# EAGLE schematic ESP32-DevKit-Si7021 (EAGLE 9.2.2)
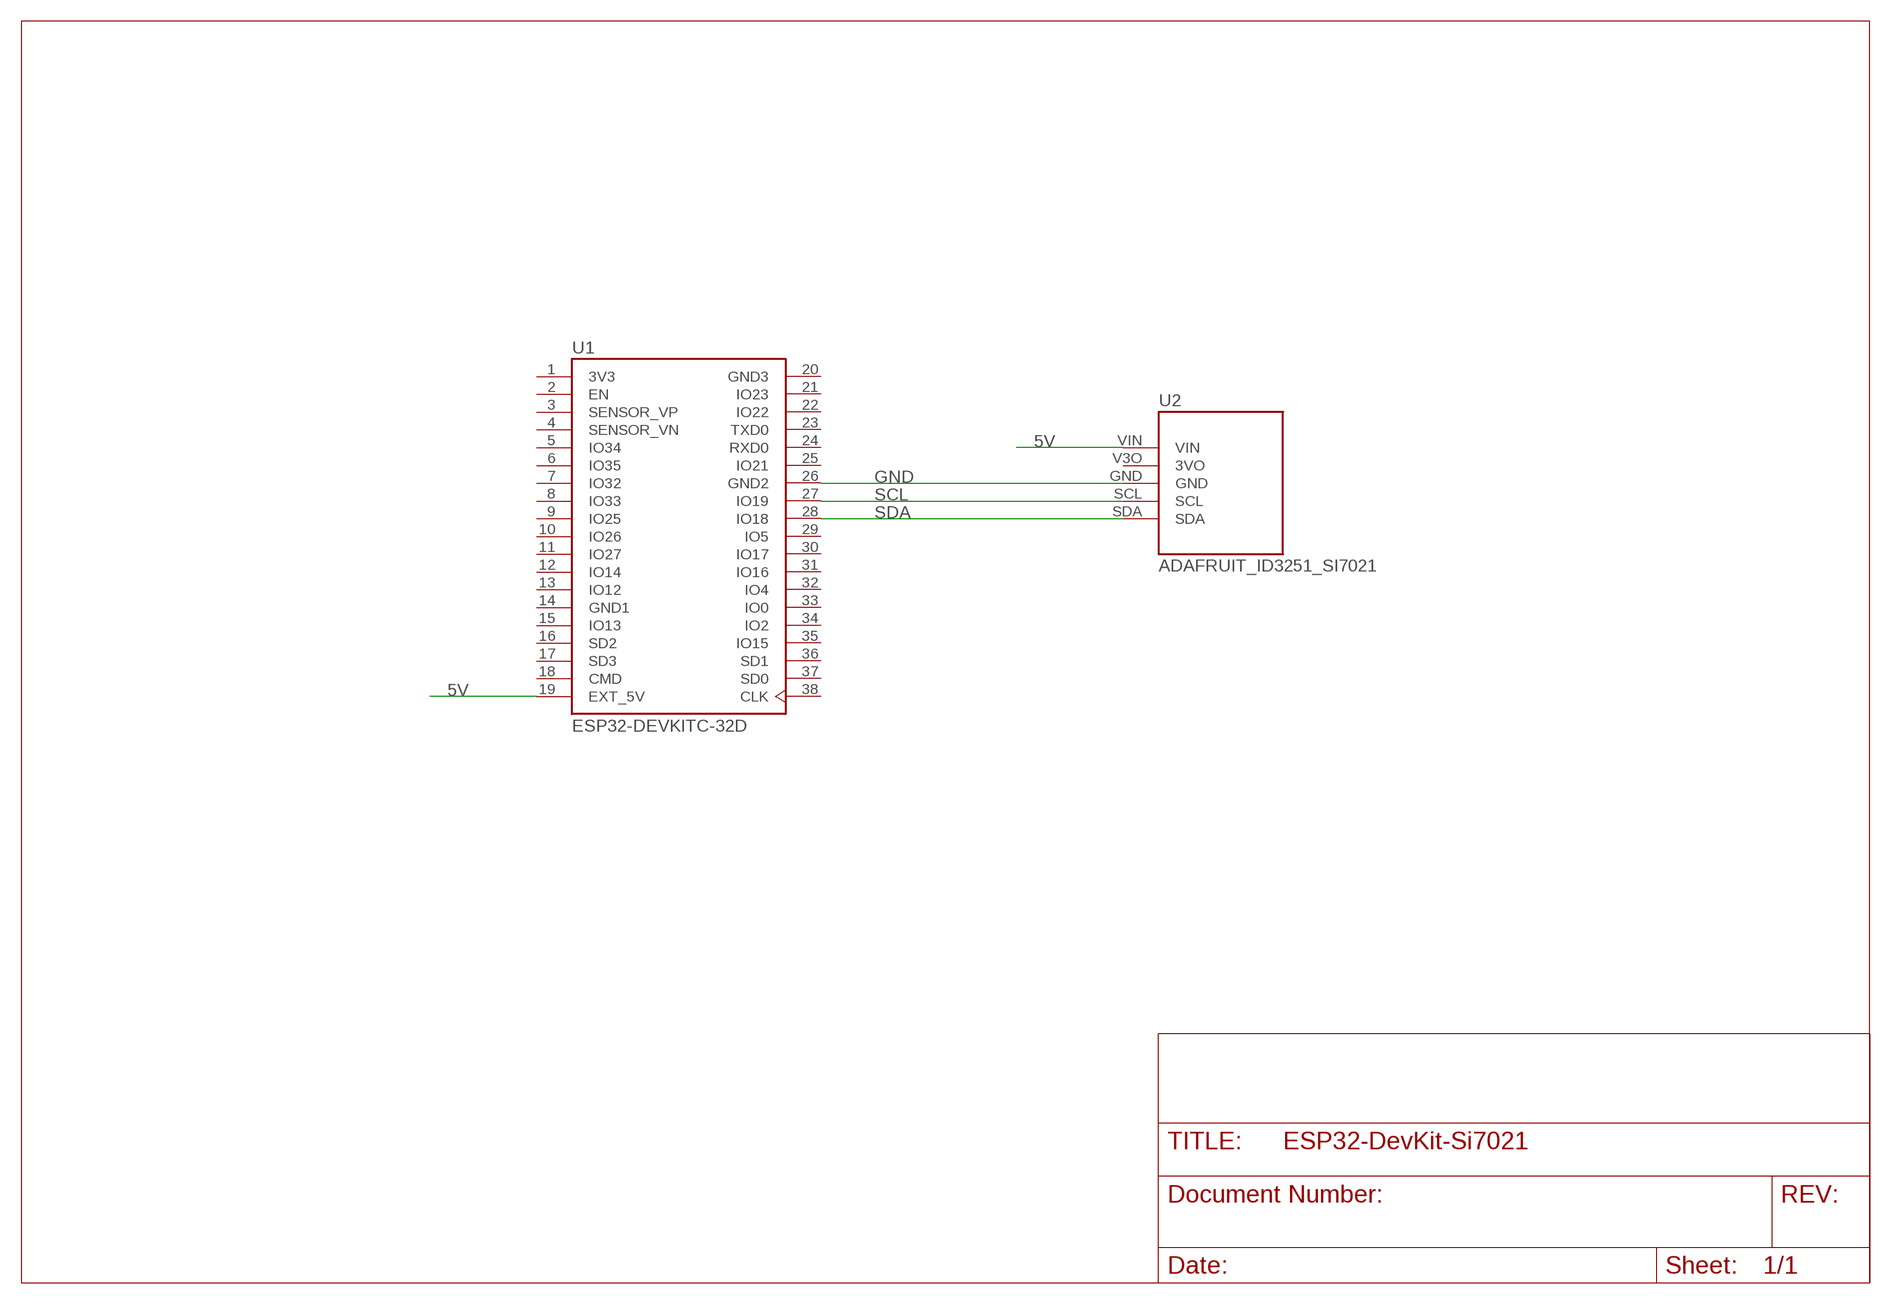
[diagram p0: schematic, sheet 1]

## Parts
U1  ESP32-DEVKITC-32D  [MODULE_ESP32-DEVKITC-32D]
U2  ADAFRUIT_ID3251_SI7021  [ADAFRUIT_ID3251_SI7021]

## Nets
5V: U1.19(EXT_5V) U2.VIN
GND: U1.26(GND2) U2.GND
SCL: U1.27(IO19) U2.SCL
SDA: U1.28(IO18) U2.SDA
Unconnected: U1.2(EN) U1.3(SENSOR_VP) U1.4(SENSOR_VN) U1.5(IO34) U1.6(IO35) U1.7(IO32) U1.8(IO33) U1.9(IO25) U1.10(IO26) U1.11(IO27) U1.12(IO14) U1.13(IO12) U1.15(IO13) U1.16(SD2) U1.17(SD3) U1.18(CMD) U1.21(IO23) U1.22(IO22) U1.23(TXD0) U1.24(RXD0) U1.25(IO21) U1.29(IO5) U1.30(IO17) U1.31(IO16) U1.32(IO4) U1.33(IO0) U1.34(IO2) U1.35(IO15) U1.36(SD1) U1.37(SD0) U1.38(CLK)

## Power pins joined to a net without a drawn wire
3V3: U1.1(3V3)
3VO: U2.V3O(3VO)
GND1: U1.14(GND1)
GND3: U1.20(GND3)

## Library data of the parts
U1 = ESP32-DEVKITC-32D:ESP32-DEVKITC-32D: Eval Board For Esp-Wroom-32; AVAILABILITY: Unavailable; DESCRIPTION: EVAL BOARD FOR ESP-WROOM-32; MF: Espressif Systems; MP: ESP32-DEVKITC-32D; PACKAGE: None; PRICE: None
U2 = Adafruit:ADAFRUIT_ID3251_SI7021: Adafruit Si7021 Temperature & Humidity Sensor Breakout Board